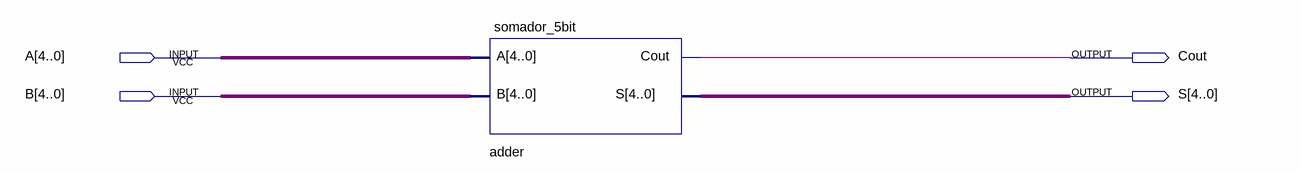
[diagram p0: schematic sheet]
// Quartus schematic Somador_5bits.bdf as structural Verilog: 1 symbols, 4 pins
module Somador_5bits (
  input  [4:0] A,
  input  [4:0] B,
  output Cout,
  output [4:0] S
);

  somador_5bit adder (.A(A), .B(B), .Cout(Cout), .S(S));
endmodule
